# EAGLE design motherboard_v1 (EAGLE 8.4.2)
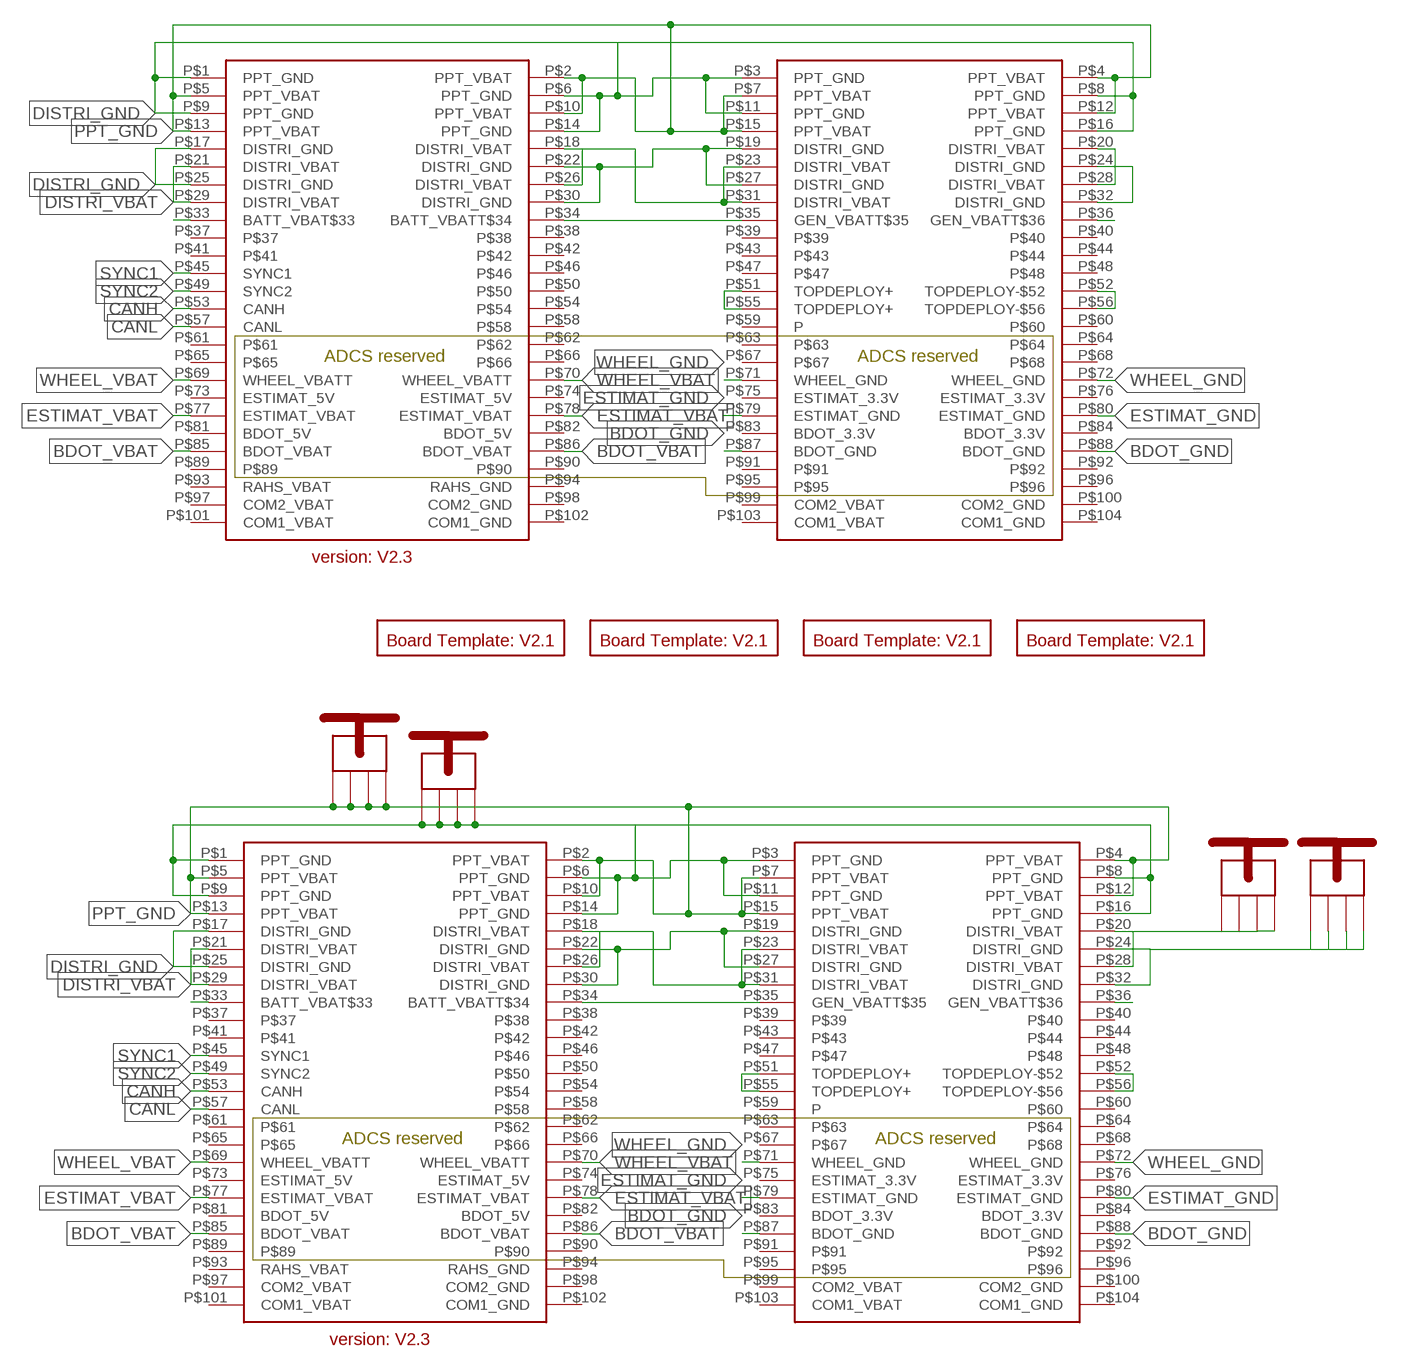
[diagram p0: schematic, sheet 1, part 1 of 2]
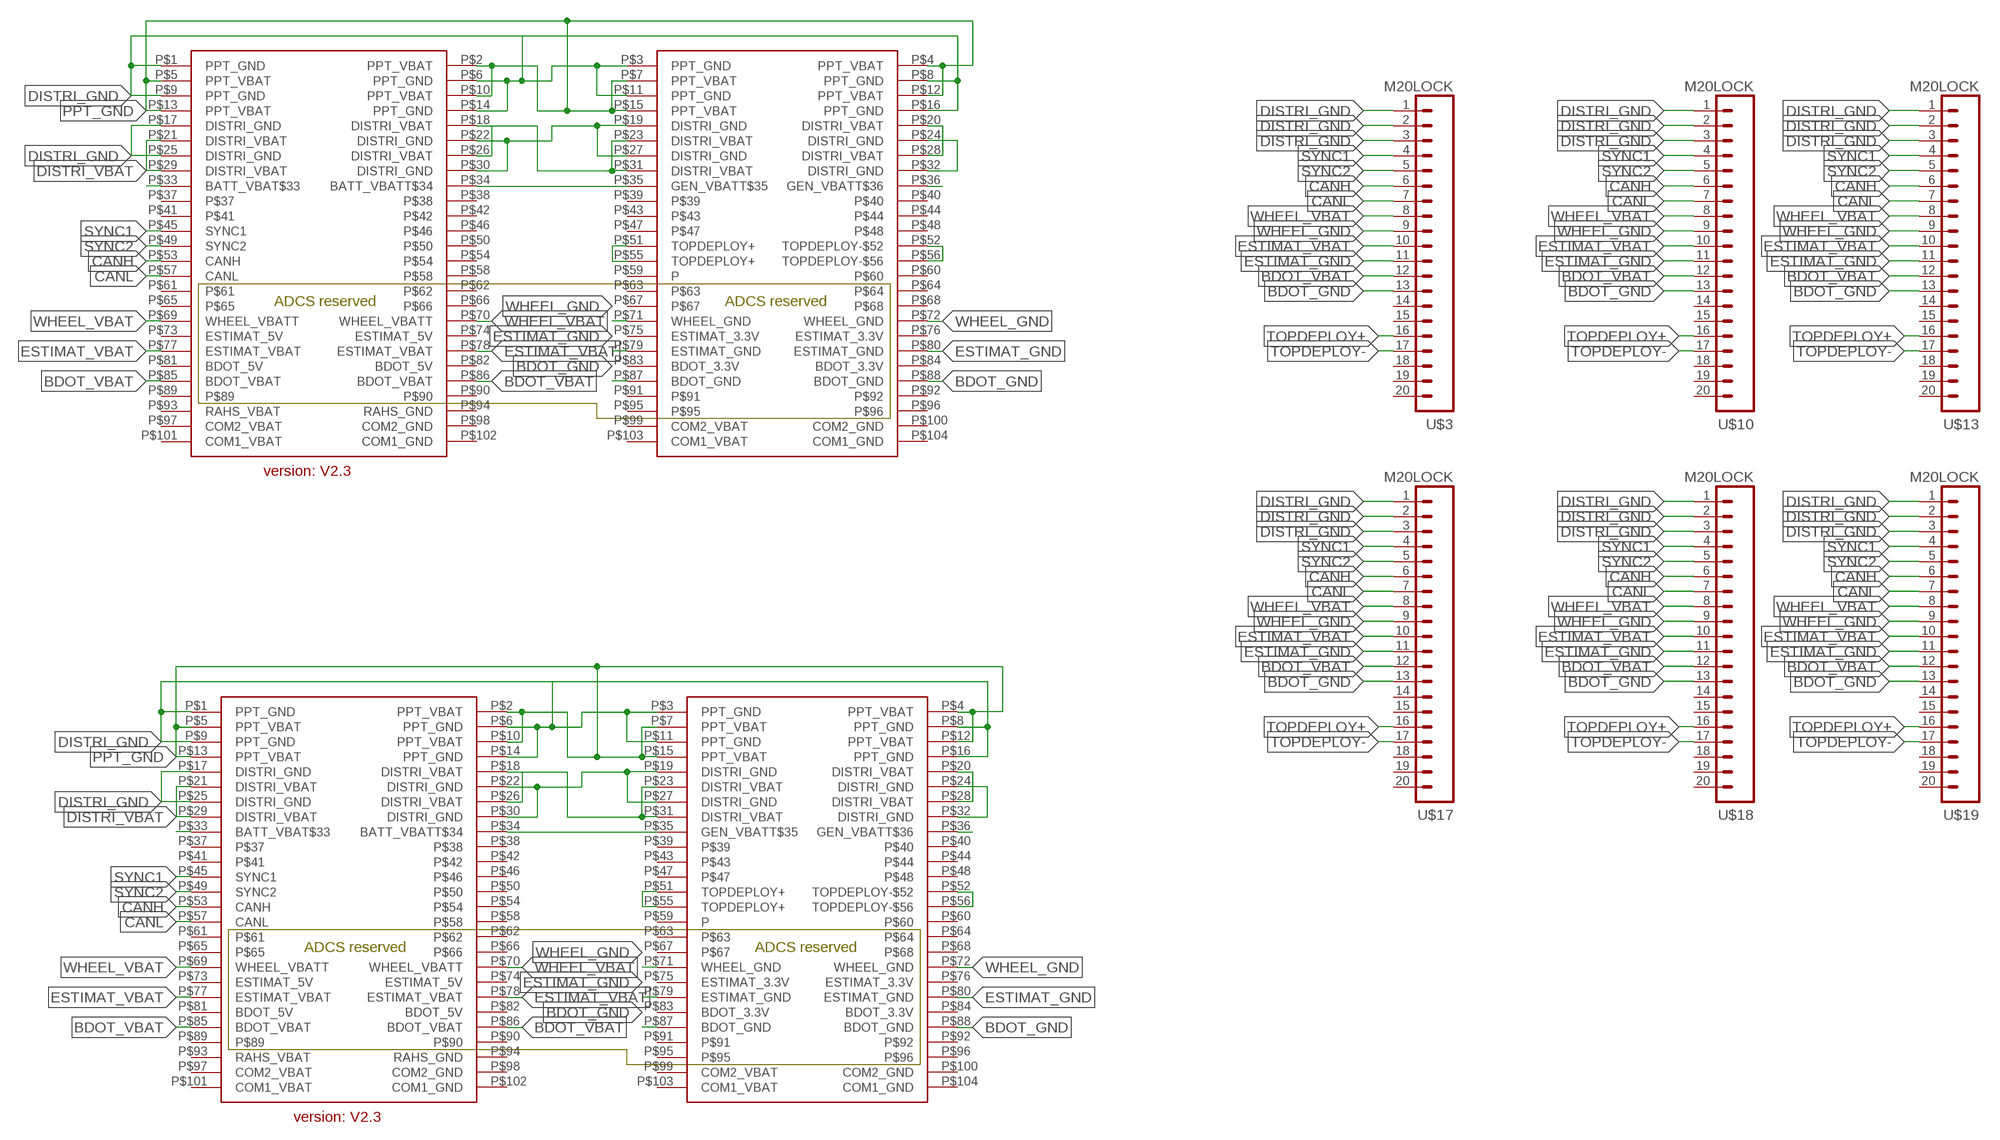
[diagram p1: schematic, sheet 1, part 2 of 2]

## Parts
JP1  KEYSTONE_SCREW_TERMINAL_7701  [7701]
JP2  KEYSTONE_SCREW_TERMINAL_7701  [7701]
JP9  KEYSTONE_SCREW_TERMINAL_7701  [7701]
JP10  KEYSTONE_SCREW_TERMINAL_7701  [7701]
U$1  BOARD_TEMPLATESILKONLY  [BOARD_TEMPLATE_SILKONLY]
U$2  PC104_CONNECTOR  [PC104_CONNECTOR]
U$3  M20LOCK  [1X20_LOCK]
U$4  BOARD_TEMPLATESILKONLY  [BOARD_TEMPLATE_SILKONLY]
U$5  BOARD_TEMPLATESILKONLY  [BOARD_TEMPLATE_SILKONLY]
U$6  BOARD_TEMPLATESILKONLY  [BOARD_TEMPLATE_SILKONLY]
U$7  PC104_CONNECTOR  [PC104_CONNECTOR]
U$9  PC104_CONNECTOR  [PC104_CONNECTOR]
U$10  M20LOCK  [1X20_LOCK]
U$11  PC104_CONNECTOR  [PC104_CONNECTOR]
U$13  M20LOCK  [1X20_LOCK]
U$17  M20LOCK  [1X20_LOCK]
U$18  M20LOCK  [1X20_LOCK]
U$19  M20LOCK  [1X20_LOCK]

## Nets
BDOT_GND: U$2.P$87(BDOT_GND) U$2.P$88(BDOT_GND) U$3.13 U$7.P$87(BDOT_GND) U$7.P$88(BDOT_GND) U$9.P$87(BDOT_GND) U$9.P$88(BDOT_GND) U$10.13 U$11.P$87(BDOT_GND) U$11.P$88(BDOT_GND) U$13.13 U$17.13 U$18.13 U$19.13
BDOT_VBAT: U$2.P$85(BDOT_VBAT) U$2.P$86(BDOT_VBAT) U$3.12 U$7.P$85(BDOT_VBAT) U$7.P$86(BDOT_VBAT) U$9.P$85(BDOT_VBAT) U$9.P$86(BDOT_VBAT) U$10.12 U$11.P$85(BDOT_VBAT) U$11.P$86(BDOT_VBAT) U$13.12 U$17.12 U$18.12 U$19.12
CANH: U$2.P$53(CANH) U$3.6 U$7.P$53(CANH) U$9.P$53(CANH) U$10.6 U$11.P$53(CANH) U$13.6 U$17.6 U$18.6 U$19.6
CANL: U$2.P$57(CANL) U$3.7 U$7.P$57(CANL) U$9.P$57(CANL) U$10.7 U$11.P$57(CANL) U$13.7 U$17.7 U$18.7 U$19.7
DISTRI_GND: JP2.P$1 JP2.P$2 JP2.P$3 JP2.P$4 JP10.P$1 JP10.P$2 JP10.P$3 JP10.P$4 U$2.P$1(PPT_GND) U$2.P$3(PPT_GND) U$2.P$6(PPT_GND) U$2.P$8(PPT_GND) U$2.P$9(PPT_GND) U$2.P$11(PPT_GND) U$2.P$14(PPT_GND) U$2.P$16(PPT_GND) U$2.P$17(DISTRI_GND) U$2.P$19(DISTRI_GND) U$2.P$22(DISTRI_GND) U$2.P$24(DISTRI_GND) U$2.P$25(DISTRI_GND) U$2.P$27(DISTRI_GND) U$2.P$30(DISTRI_GND) U$2.P$32(DISTRI_GND) U$3.1 U$3.2 U$3.3 U$7.P$1(PPT_GND) U$7.P$3(PPT_GND) U$7.P$6(PPT_GND) U$7.P$8(PPT_GND) U$7.P$9(PPT_GND) U$7.P$11(PPT_GND) U$7.P$14(PPT_GND) U$7.P$16(PPT_GND) U$7.P$17(DISTRI_GND) U$7.P$19(DISTRI_GND) U$7.P$22(DISTRI_GND) U$7.P$24(DISTRI_GND) U$7.P$25(DISTRI_GND) U$7.P$27(DISTRI_GND) U$7.P$30(DISTRI_GND) U$7.P$32(DISTRI_GND) U$9.P$1(PPT_GND) U$9.P$3(PPT_GND) U$9.P$6(PPT_GND) U$9.P$8(PPT_GND) U$9.P$9(PPT_GND) U$9.P$11(PPT_GND) U$9.P$14(PPT_GND) U$9.P$16(PPT_GND) U$9.P$17(DISTRI_GND) U$9.P$19(DISTRI_GND) U$9.P$22(DISTRI_GND) U$9.P$24(DISTRI_GND) U$9.P$25(DISTRI_GND) U$9.P$27(DISTRI_GND) U$9.P$30(DISTRI_GND) U$9.P$32(DISTRI_GND) U$10.1 U$10.2 U$10.3 U$11.P$1(PPT_GND) U$11.P$3(PPT_GND) U$11.P$6(PPT_GND) U$11.P$8(PPT_GND) U$11.P$9(PPT_GND) U$11.P$11(PPT_GND) U$11.P$14(PPT_GND) U$11.P$16(PPT_GND) U$11.P$17(DISTRI_GND) U$11.P$19(DISTRI_GND) U$11.P$22(DISTRI_GND) U$11.P$24(DISTRI_GND) U$11.P$25(DISTRI_GND) U$11.P$27(DISTRI_GND) U$11.P$30(DISTRI_GND) U$11.P$32(DISTRI_GND) U$13.1 U$13.2 U$13.3 U$17.1 U$17.2 U$17.3 U$18.1 U$18.2 U$18.3 U$19.1 U$19.2 U$19.3
DISTRI_VBAT: JP1.P$1 JP1.P$2 JP1.P$3 JP1.P$4 U$2.P$18(DISTRI_VBAT) U$2.P$20(DISTRI_VBAT) U$2.P$21(DISTRI_VBAT) U$2.P$23(DISTRI_VBAT) U$2.P$26(DISTRI_VBAT) U$2.P$28(DISTRI_VBAT) U$2.P$29(DISTRI_VBAT) U$2.P$31(DISTRI_VBAT) U$7.P$18(DISTRI_VBAT) U$7.P$20(DISTRI_VBAT) U$7.P$21(DISTRI_VBAT) U$7.P$23(DISTRI_VBAT) U$7.P$26(DISTRI_VBAT) U$7.P$28(DISTRI_VBAT) U$7.P$29(DISTRI_VBAT) U$7.P$31(DISTRI_VBAT) U$9.P$18(DISTRI_VBAT) U$9.P$20(DISTRI_VBAT) U$9.P$21(DISTRI_VBAT) U$9.P$23(DISTRI_VBAT) U$9.P$26(DISTRI_VBAT) U$9.P$28(DISTRI_VBAT) U$9.P$29(DISTRI_VBAT) U$9.P$31(DISTRI_VBAT) U$11.P$18(DISTRI_VBAT) U$11.P$20(DISTRI_VBAT) U$11.P$21(DISTRI_VBAT) U$11.P$23(DISTRI_VBAT) U$11.P$26(DISTRI_VBAT) U$11.P$28(DISTRI_VBAT) U$11.P$29(DISTRI_VBAT) U$11.P$31(DISTRI_VBAT)
EPS: U$2.P$33(BATT_VBAT$33) U$2.P$34(BATT_VBATT$34) U$2.P$35(GEN_VBATT$35) U$2.P$36(GEN_VBATT$36) U$7.P$33(BATT_VBAT$33) U$7.P$34(BATT_VBATT$34) U$7.P$35(GEN_VBATT$35) U$7.P$36(GEN_VBATT$36) U$9.P$33(BATT_VBAT$33) U$9.P$34(BATT_VBATT$34) U$9.P$35(GEN_VBATT$35) U$9.P$36(GEN_VBATT$36) U$11.P$33(BATT_VBAT$33) U$11.P$34(BATT_VBATT$34) U$11.P$35(GEN_VBATT$35) U$11.P$36(GEN_VBATT$36)
ESTIMAT_GND: U$2.P$79(ESTIMAT_GND) U$2.P$80(ESTIMAT_GND) U$3.11 U$7.P$79(ESTIMAT_GND) U$7.P$80(ESTIMAT_GND) U$9.P$79(ESTIMAT_GND) U$9.P$80(ESTIMAT_GND) U$10.11 U$11.P$79(ESTIMAT_GND) U$11.P$80(ESTIMAT_GND) U$13.11 U$17.11 U$18.11 U$19.11
ESTIMAT_VBAT: U$2.P$77(ESTIMAT_VBAT) U$2.P$78(ESTIMAT_VBAT) U$3.10 U$7.P$77(ESTIMAT_VBAT) U$7.P$78(ESTIMAT_VBAT) U$9.P$77(ESTIMAT_VBAT) U$9.P$78(ESTIMAT_VBAT) U$10.10 U$11.P$77(ESTIMAT_VBAT) U$11.P$78(ESTIMAT_VBAT) U$13.10 U$17.10 U$18.10 U$19.10
PPT_GND: JP9.P$1 JP9.P$2 JP9.P$3 JP9.P$4 U$2.P$2(PPT_VBAT) U$2.P$4(PPT_VBAT) U$2.P$5(PPT_VBAT) U$2.P$7(PPT_VBAT) U$2.P$10(PPT_VBAT) U$2.P$12(PPT_VBAT) U$2.P$13(PPT_VBAT) U$2.P$15(PPT_VBAT) U$7.P$2(PPT_VBAT) U$7.P$4(PPT_VBAT) U$7.P$5(PPT_VBAT) U$7.P$7(PPT_VBAT) U$7.P$10(PPT_VBAT) U$7.P$12(PPT_VBAT) U$7.P$13(PPT_VBAT) U$7.P$15(PPT_VBAT) U$9.P$2(PPT_VBAT) U$9.P$4(PPT_VBAT) U$9.P$5(PPT_VBAT) U$9.P$7(PPT_VBAT) U$9.P$10(PPT_VBAT) U$9.P$12(PPT_VBAT) U$9.P$13(PPT_VBAT) U$9.P$15(PPT_VBAT) U$11.P$2(PPT_VBAT) U$11.P$4(PPT_VBAT) U$11.P$5(PPT_VBAT) U$11.P$7(PPT_VBAT) U$11.P$10(PPT_VBAT) U$11.P$12(PPT_VBAT) U$11.P$13(PPT_VBAT) U$11.P$15(PPT_VBAT)
SYNC1: U$2.P$45(SYNC1) U$3.4 U$7.P$45(SYNC1) U$9.P$45(SYNC1) U$10.4 U$11.P$45(SYNC1) U$13.4 U$17.4 U$18.4 U$19.4
SYNC2: U$2.P$49(SYNC2) U$3.5 U$7.P$49(SYNC2) U$9.P$49(SYNC2) U$10.5 U$11.P$49(SYNC2) U$13.5 U$17.5 U$18.5 U$19.5
TOPDEPLOY+: U$2.P$51(TOPDEPLOY+) U$2.P$55(TOPDEPLOY+) U$3.16 U$7.P$51(TOPDEPLOY+) U$7.P$55(TOPDEPLOY+) U$9.P$51(TOPDEPLOY+) U$9.P$55(TOPDEPLOY+) U$10.16 U$11.P$51(TOPDEPLOY+) U$11.P$55(TOPDEPLOY+) U$13.16 U$17.16 U$18.16 U$19.16
TOPDEPLOY-: U$2.P$52(TOPDEPLOY-$52) U$2.P$56(TOPDEPLOY-$56) U$3.17 U$7.P$52(TOPDEPLOY-$52) U$7.P$56(TOPDEPLOY-$56) U$9.P$52(TOPDEPLOY-$52) U$9.P$56(TOPDEPLOY-$56) U$10.17 U$11.P$52(TOPDEPLOY-$52) U$11.P$56(TOPDEPLOY-$56) U$13.17 U$17.17 U$18.17 U$19.17
WHEEL_GND: U$2.P$71(WHEEL_GND) U$2.P$72(WHEEL_GND) U$3.9 U$7.P$71(WHEEL_GND) U$7.P$72(WHEEL_GND) U$9.P$71(WHEEL_GND) U$9.P$72(WHEEL_GND) U$10.9 U$11.P$71(WHEEL_GND) U$11.P$72(WHEEL_GND) U$13.9 U$17.9 U$18.9 U$19.9
WHEEL_VBAT: U$2.P$69(WHEEL_VBATT) U$2.P$70(WHEEL_VBATT) U$3.8 U$7.P$69(WHEEL_VBATT) U$7.P$70(WHEEL_VBATT) U$9.P$69(WHEEL_VBATT) U$9.P$70(WHEEL_VBATT) U$10.8 U$11.P$69(WHEEL_VBATT) U$11.P$70(WHEEL_VBATT) U$13.8 U$17.8 U$18.8 U$19.8
Unconnected: U$2.P$37 U$2.P$38 U$2.P$39 U$2.P$40 U$2.P$41 U$2.P$42 U$2.P$43 U$2.P$44 U$2.P$46 U$2.P$47 U$2.P$48 U$2.P$50 U$2.P$54 U$2.P$58 U$2.P$59(P) U$2.P$60 U$2.P$61 U$2.P$62 U$2.P$63 U$2.P$64 U$2.P$65 U$2.P$66 U$2.P$67 U$2.P$68 U$2.P$73(ESTIMAT_5V) U$2.P$74(ESTIMAT_5V) U$2.P$75(ESTIMAT_3.3V) U$2.P$76(ESTIMAT_3.3V) U$2.P$81(BDOT_5V) U$2.P$82(BDOT_5V) U$2.P$83(BDOT_3.3V) U$2.P$84(BDOT_3.3V) U$2.P$89 U$2.P$90 U$2.P$91 U$2.P$92 U$2.P$93(RAHS_VBAT) U$2.P$94(RAHS_GND) U$2.P$95 U$2.P$96 U$2.P$97(COM2_VBAT) U$2.P$98(COM2_GND) U$2.P$99(COM2_VBAT) U$2.P$100(COM2_GND) U$2.P$101(COM1_VBAT) U$2.P$102(COM1_GND) U$2.P$103(COM1_VBAT) U$2.P$104(COM1_GND) U$3.14 U$3.15 U$3.18 U$3.19 U$3.20 U$7.P$37 U$7.P$38 U$7.P$39 U$7.P$40 U$7.P$41 U$7.P$42 U$7.P$43 U$7.P$44 U$7.P$46 U$7.P$47 U$7.P$48 U$7.P$50 U$7.P$54 U$7.P$58 U$7.P$59(P) U$7.P$60 U$7.P$61 U$7.P$62 U$7.P$63 U$7.P$64 U$7.P$65 U$7.P$66 U$7.P$67 U$7.P$68 U$7.P$73(ESTIMAT_5V) U$7.P$74(ESTIMAT_5V) U$7.P$75(ESTIMAT_3.3V) U$7.P$76(ESTIMAT_3.3V) U$7.P$81(BDOT_5V) U$7.P$82(BDOT_5V) U$7.P$83(BDOT_3.3V) U$7.P$84(BDOT_3.3V) U$7.P$89 U$7.P$90 U$7.P$91 U$7.P$92 U$7.P$93(RAHS_VBAT) U$7.P$94(RAHS_GND) U$7.P$95 U$7.P$96 U$7.P$97(COM2_VBAT) U$7.P$98(COM2_GND) U$7.P$99(COM2_VBAT) U$7.P$100(COM2_GND) U$7.P$101(COM1_VBAT) U$7.P$102(COM1_GND) U$7.P$103(COM1_VBAT) U$7.P$104(COM1_GND) U$9.P$37 U$9.P$38 U$9.P$39 U$9.P$40 U$9.P$41 U$9.P$42 U$9.P$43 U$9.P$44 U$9.P$46 U$9.P$47 U$9.P$48 U$9.P$50 U$9.P$54 U$9.P$58 U$9.P$59(P) U$9.P$60 U$9.P$61 U$9.P$62 U$9.P$63 U$9.P$64 U$9.P$65 U$9.P$66 U$9.P$67 U$9.P$68 U$9.P$73(ESTIMAT_5V) U$9.P$74(ESTIMAT_5V) U$9.P$75(ESTIMAT_3.3V) U$9.P$76(ESTIMAT_3.3V) U$9.P$81(BDOT_5V) U$9.P$82(BDOT_5V) U$9.P$83(BDOT_3.3V) U$9.P$84(BDOT_3.3V) U$9.P$89 U$9.P$90 U$9.P$91 U$9.P$92 U$9.P$93(RAHS_VBAT) U$9.P$94(RAHS_GND) U$9.P$95 U$9.P$96 U$9.P$97(COM2_VBAT) U$9.P$98(COM2_GND) U$9.P$99(COM2_VBAT) U$9.P$100(COM2_GND) U$9.P$101(COM1_VBAT) U$9.P$102(COM1_GND) U$9.P$103(COM1_VBAT) U$9.P$104(COM1_GND) U$10.14 U$10.15 U$10.18 U$10.19 U$10.20 U$11.P$37 U$11.P$38 U$11.P$39 U$11.P$40 U$11.P$41 U$11.P$42 U$11.P$43 U$11.P$44 U$11.P$46 U$11.P$47 U$11.P$48 U$11.P$50 U$11.P$54 U$11.P$58 U$11.P$59(P) U$11.P$60 U$11.P$61 U$11.P$62 U$11.P$63 U$11.P$64 U$11.P$65 U$11.P$66 U$11.P$67 U$11.P$68 U$11.P$73(ESTIMAT_5V) U$11.P$74(ESTIMAT_5V) U$11.P$75(ESTIMAT_3.3V) U$11.P$76(ESTIMAT_3.3V) U$11.P$81(BDOT_5V) U$11.P$82(BDOT_5V) U$11.P$83(BDOT_3.3V) U$11.P$84(BDOT_3.3V) U$11.P$89 U$11.P$90 U$11.P$91 U$11.P$92 U$11.P$93(RAHS_VBAT) U$11.P$94(RAHS_GND) U$11.P$95 U$11.P$96 U$11.P$97(COM2_VBAT) U$11.P$98(COM2_GND) U$11.P$99(COM2_VBAT) U$11.P$100(COM2_GND) U$11.P$101(COM1_VBAT) U$11.P$102(COM1_GND) U$11.P$103(COM1_VBAT) U$11.P$104(COM1_GND) U$13.14 U$13.15 U$13.18 U$13.19 U$13.20 U$17.14 U$17.15 U$17.18 U$17.19 U$17.20 U$18.14 U$18.15 U$18.18 U$18.19 U$18.20 U$19.14 U$19.15 U$19.18 U$19.19 U$19.20

## Library data of the parts
JP1 JP2 JP9 JP10 = I_O_connectors:KEYSTONE_SCREW_TERMINAL_7701
U$1 U$4-U$6 = DubSat1 Components:BOARD_TEMPLATE
U$2 U$7 U$9 U$11 = DubSat1 Components:PC104_CONNECTOR
U$3 U$10 U$13 U$17-U$19 = SparkFun-Connectors:M20: 1x20 .1" header This is just like the LOCK variant in that the holes are staggared by 5 mil, but except for the last two holes. They are not altered from the "standard" footprint layout. This is used for a special purpose on the layout of our Graphic LCD Backpack. Make sure you want to use this device before selecting it for you project!

## Board
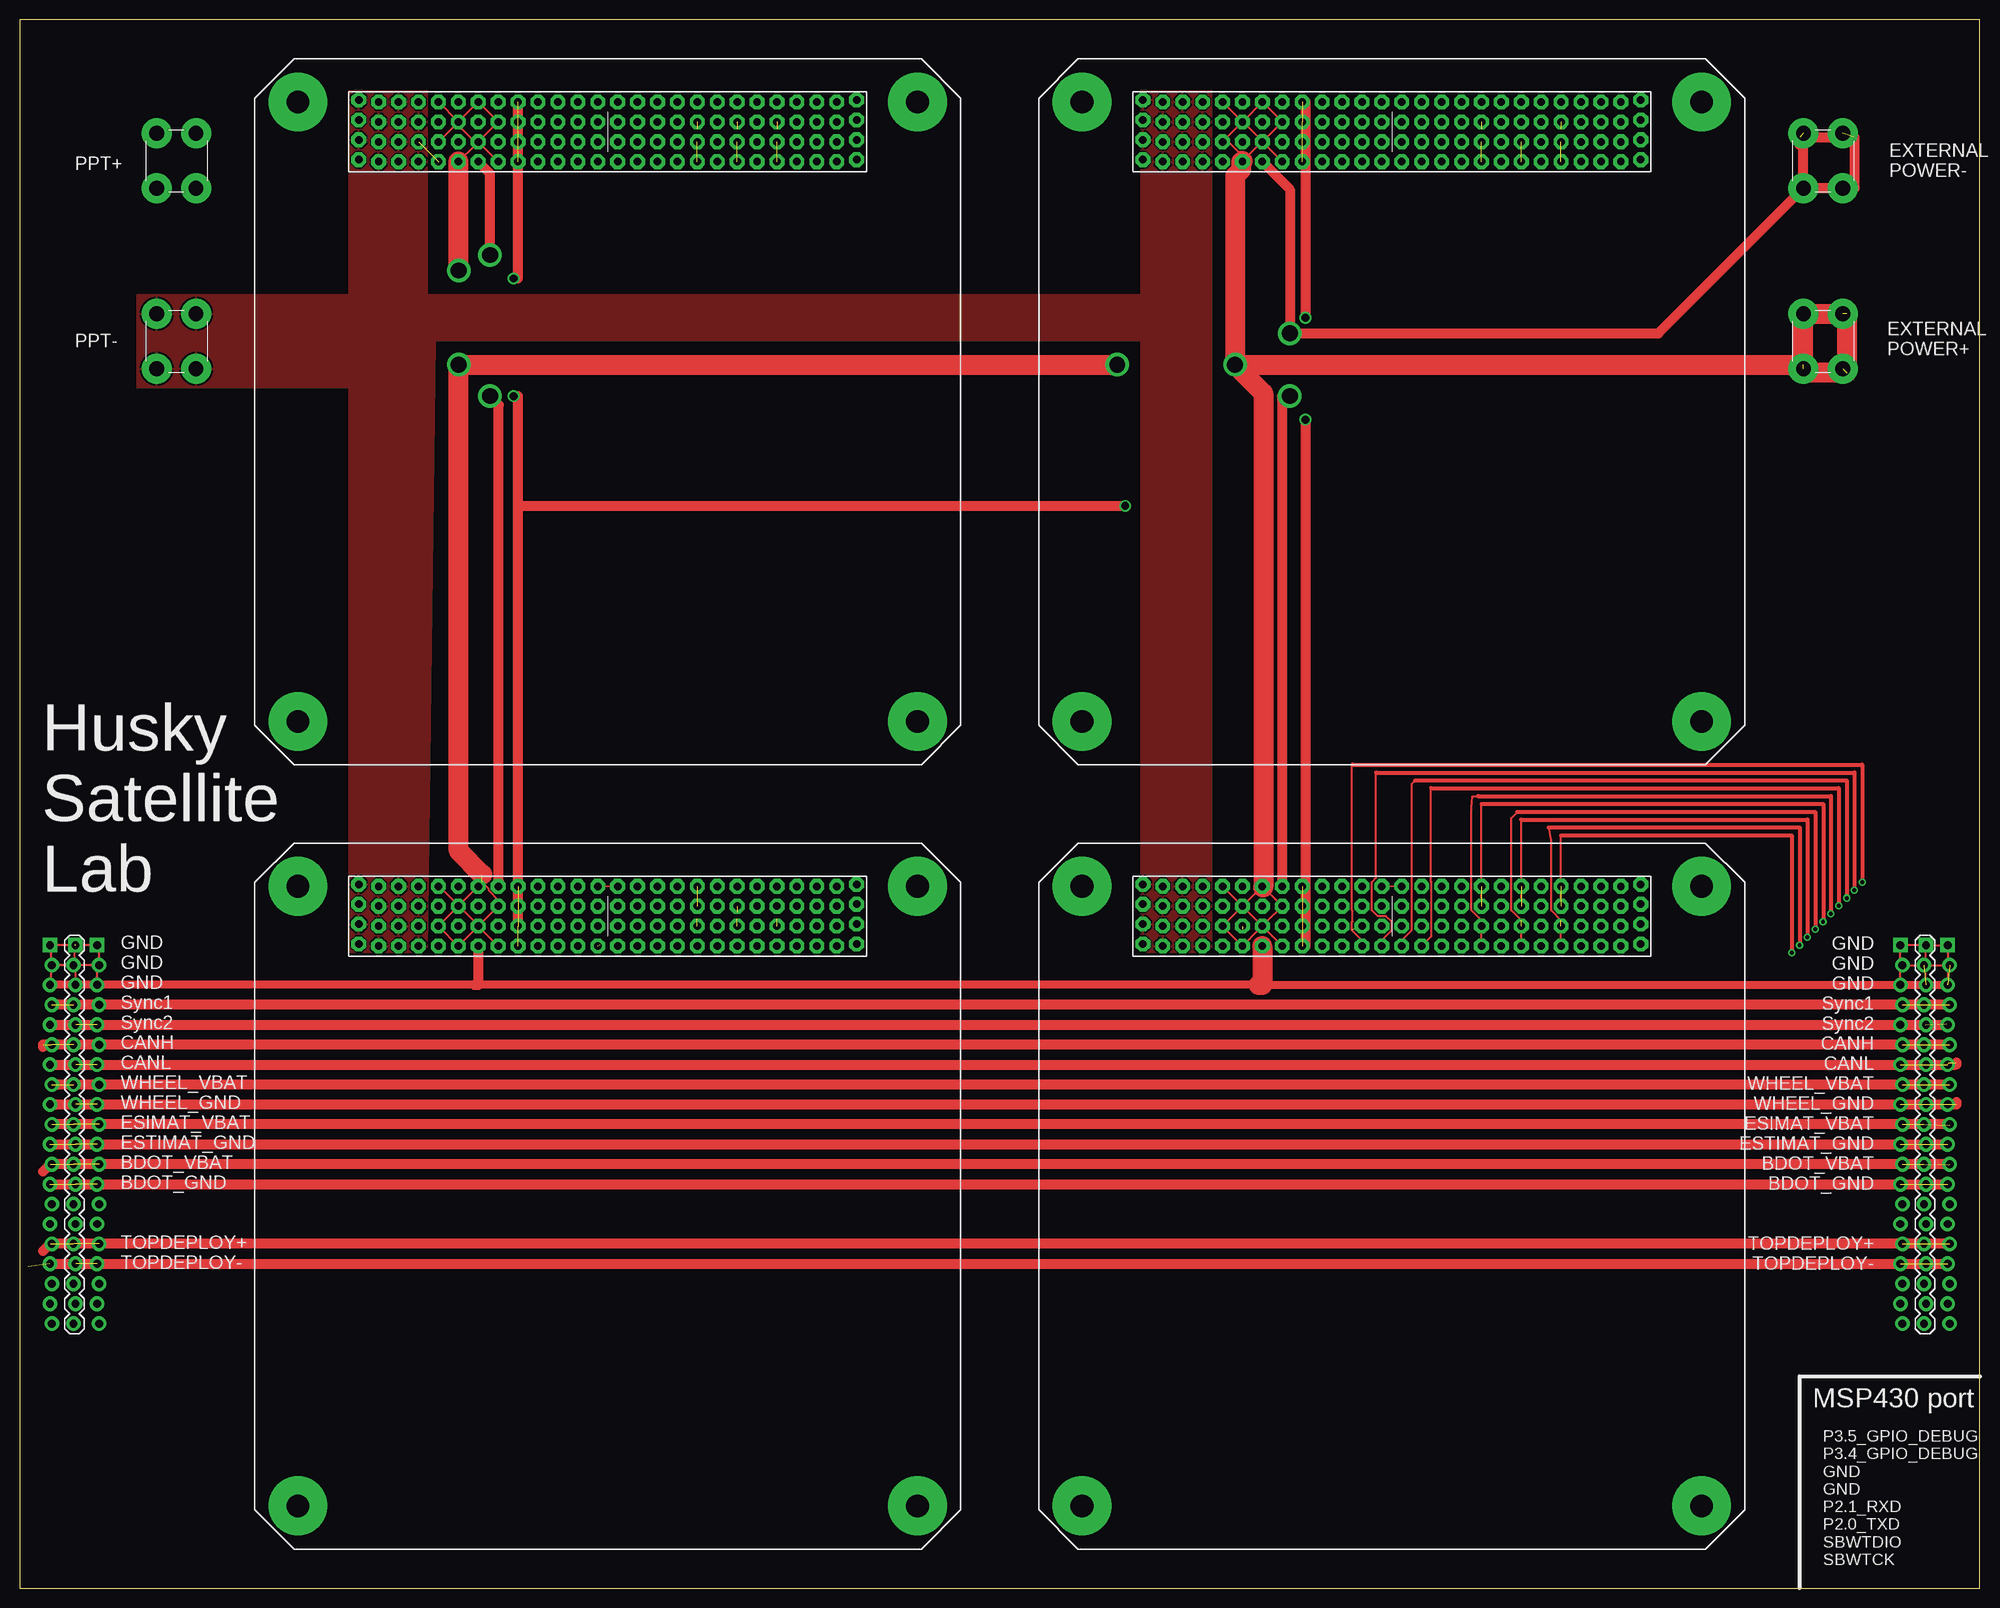
[diagram p2: board, top side]
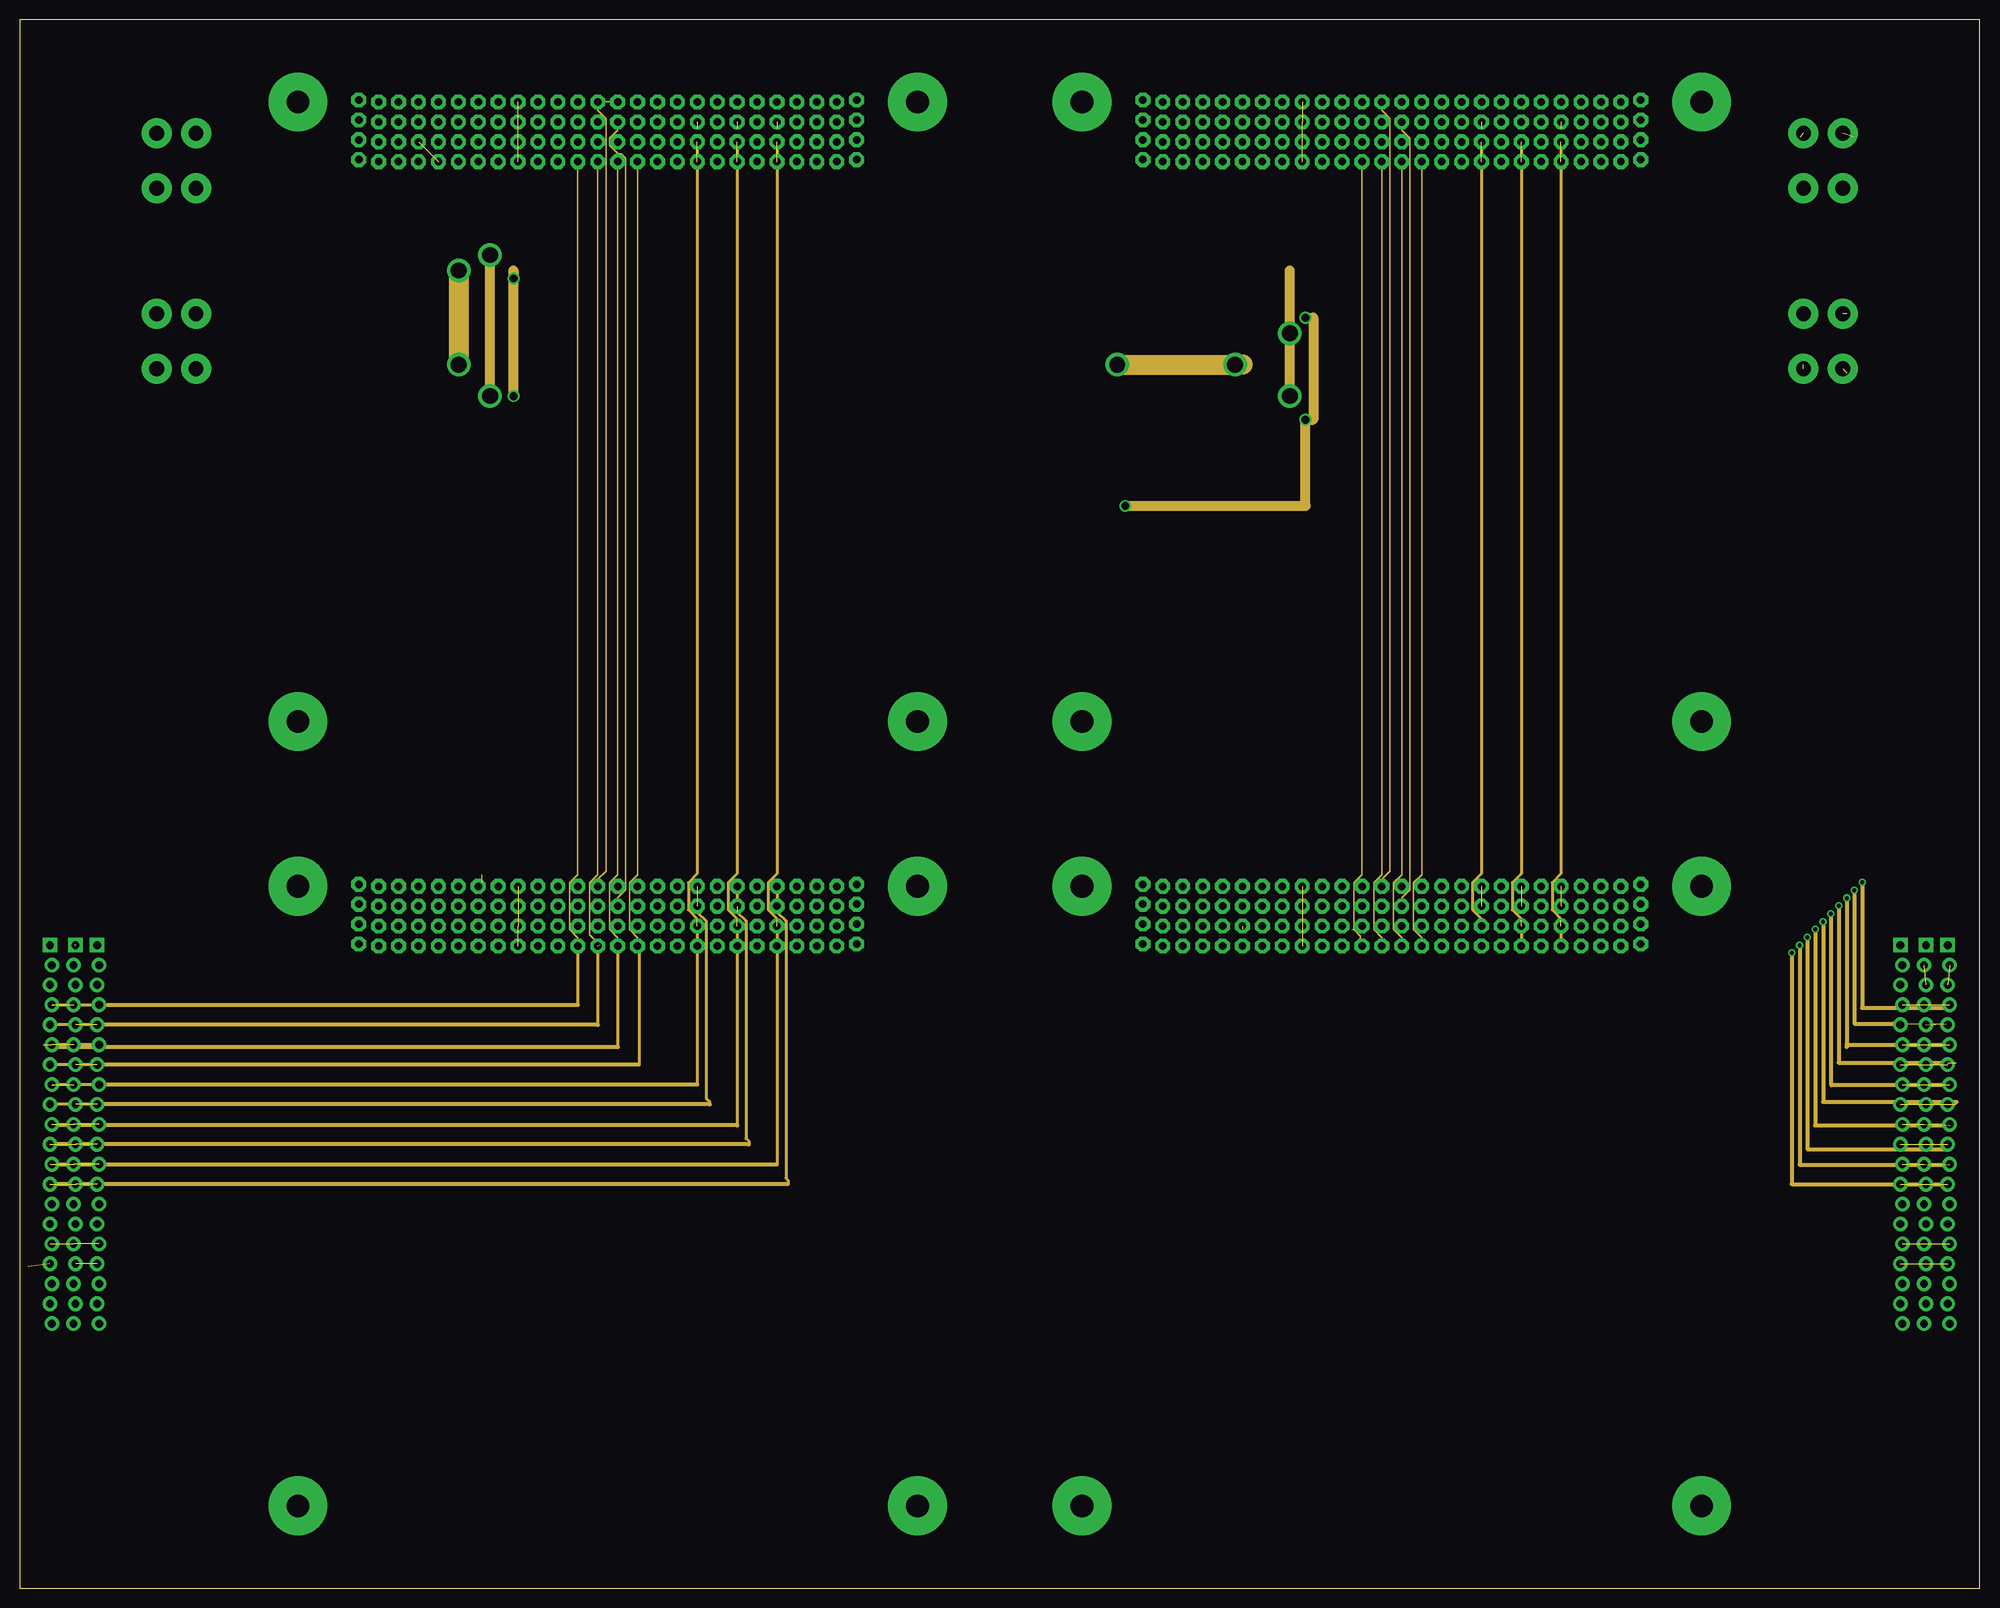
[diagram p3: board, inner layer Route2]
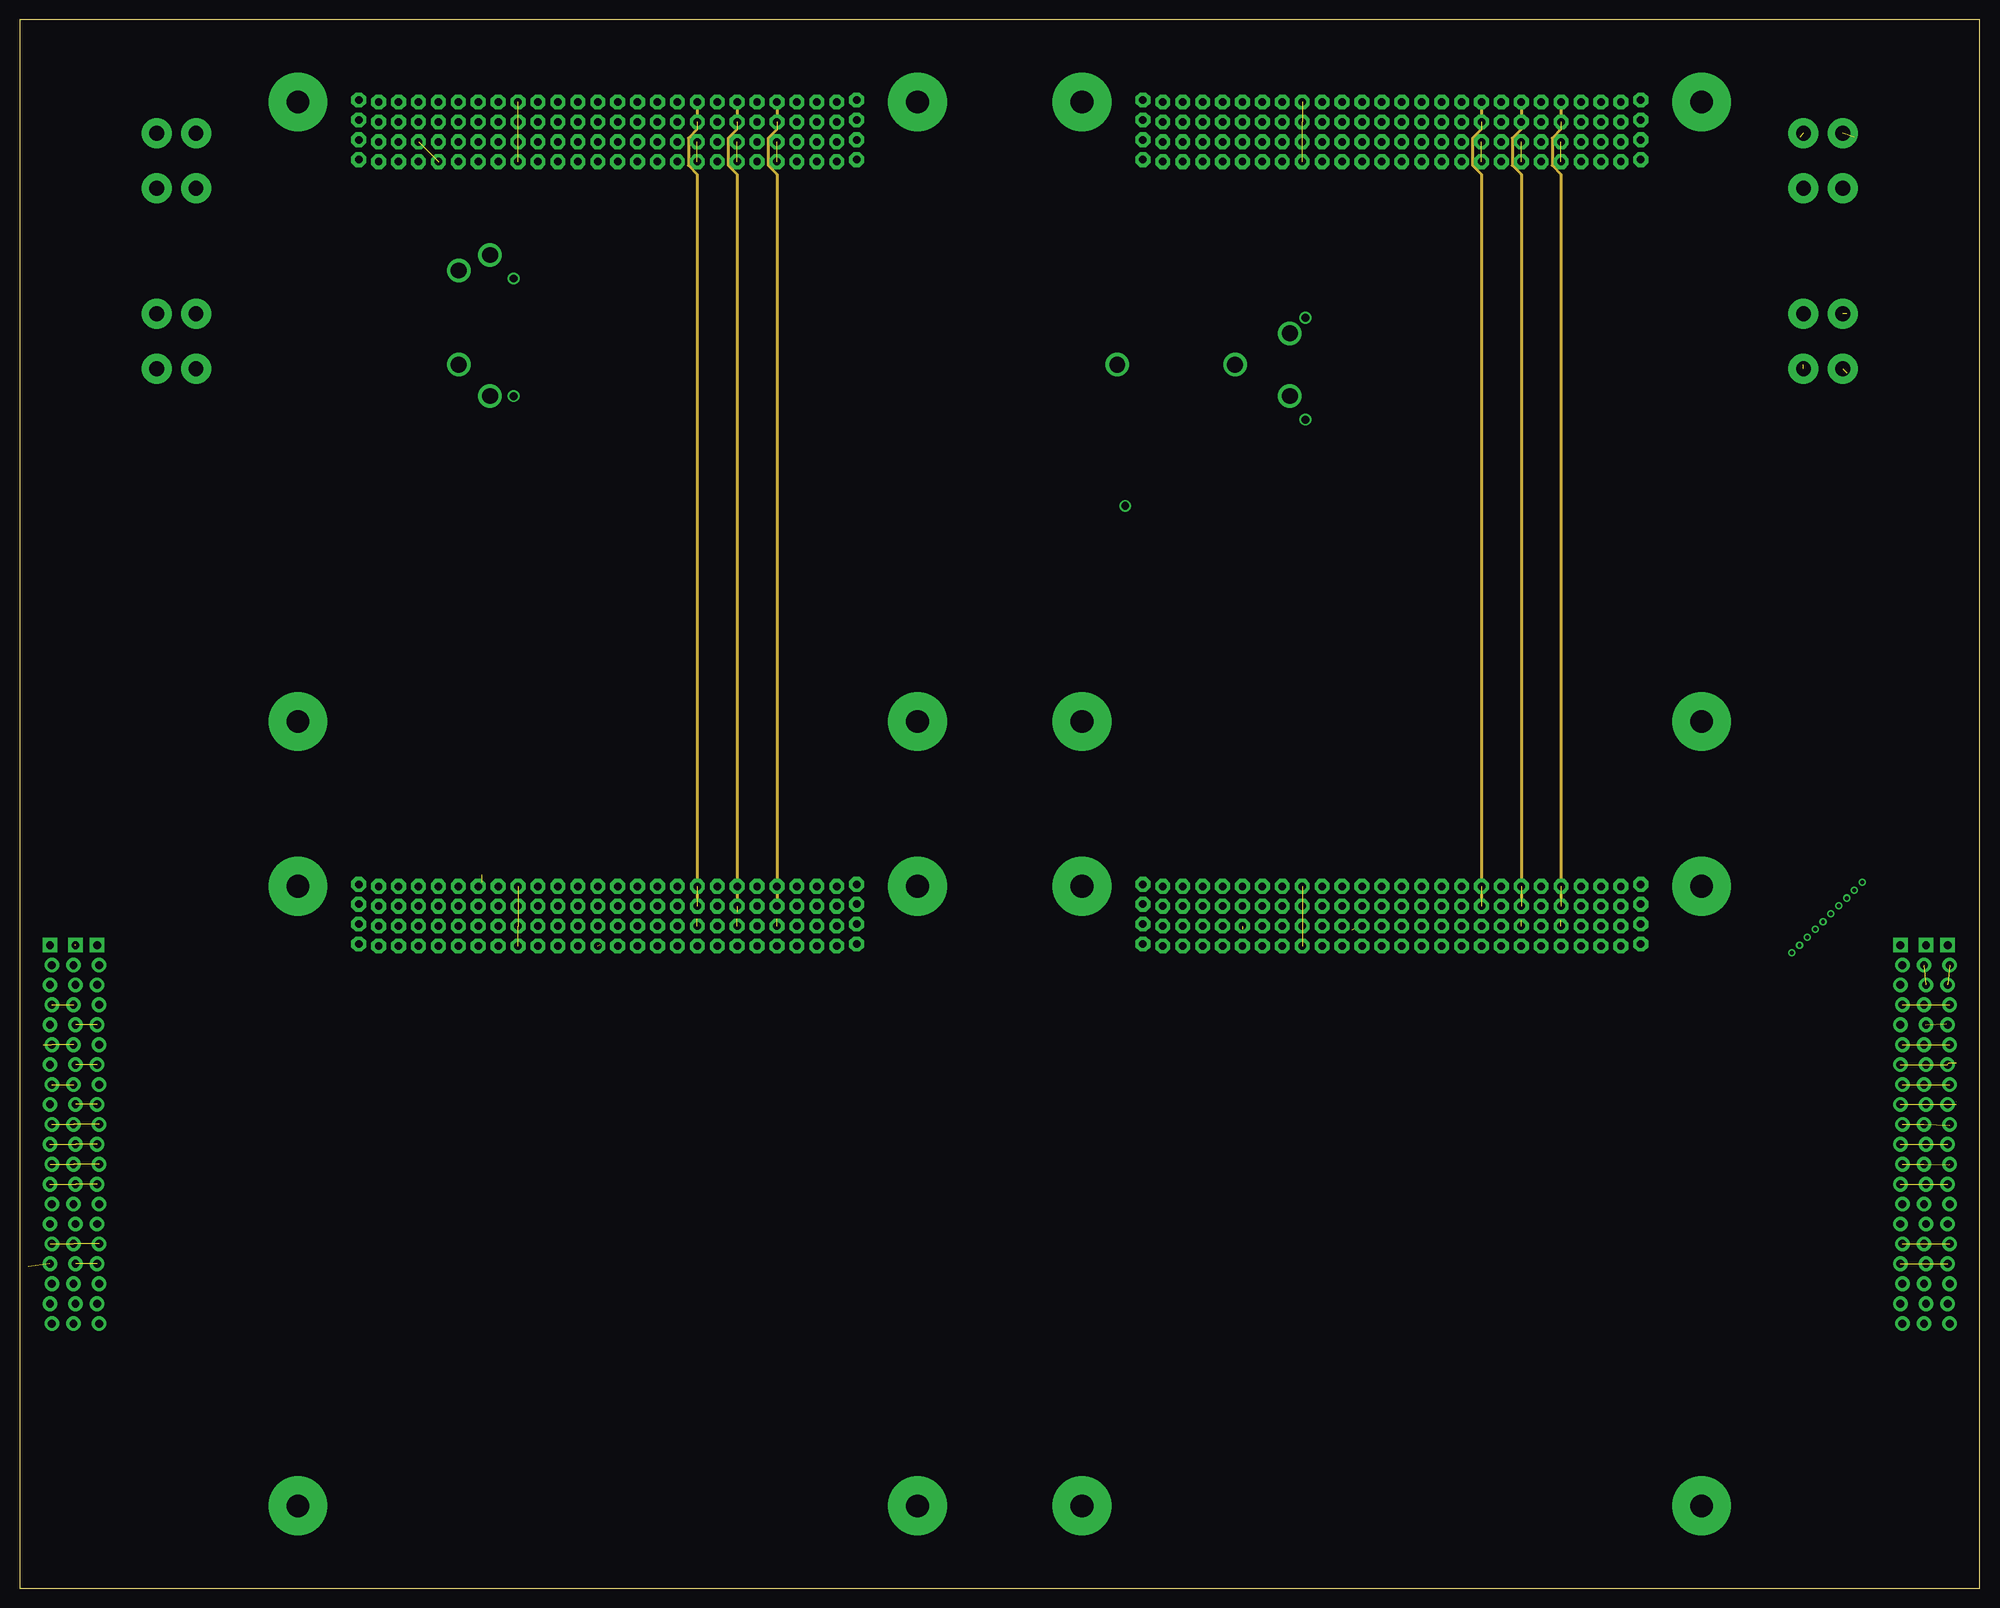
[diagram p4: board, inner layer Route3]
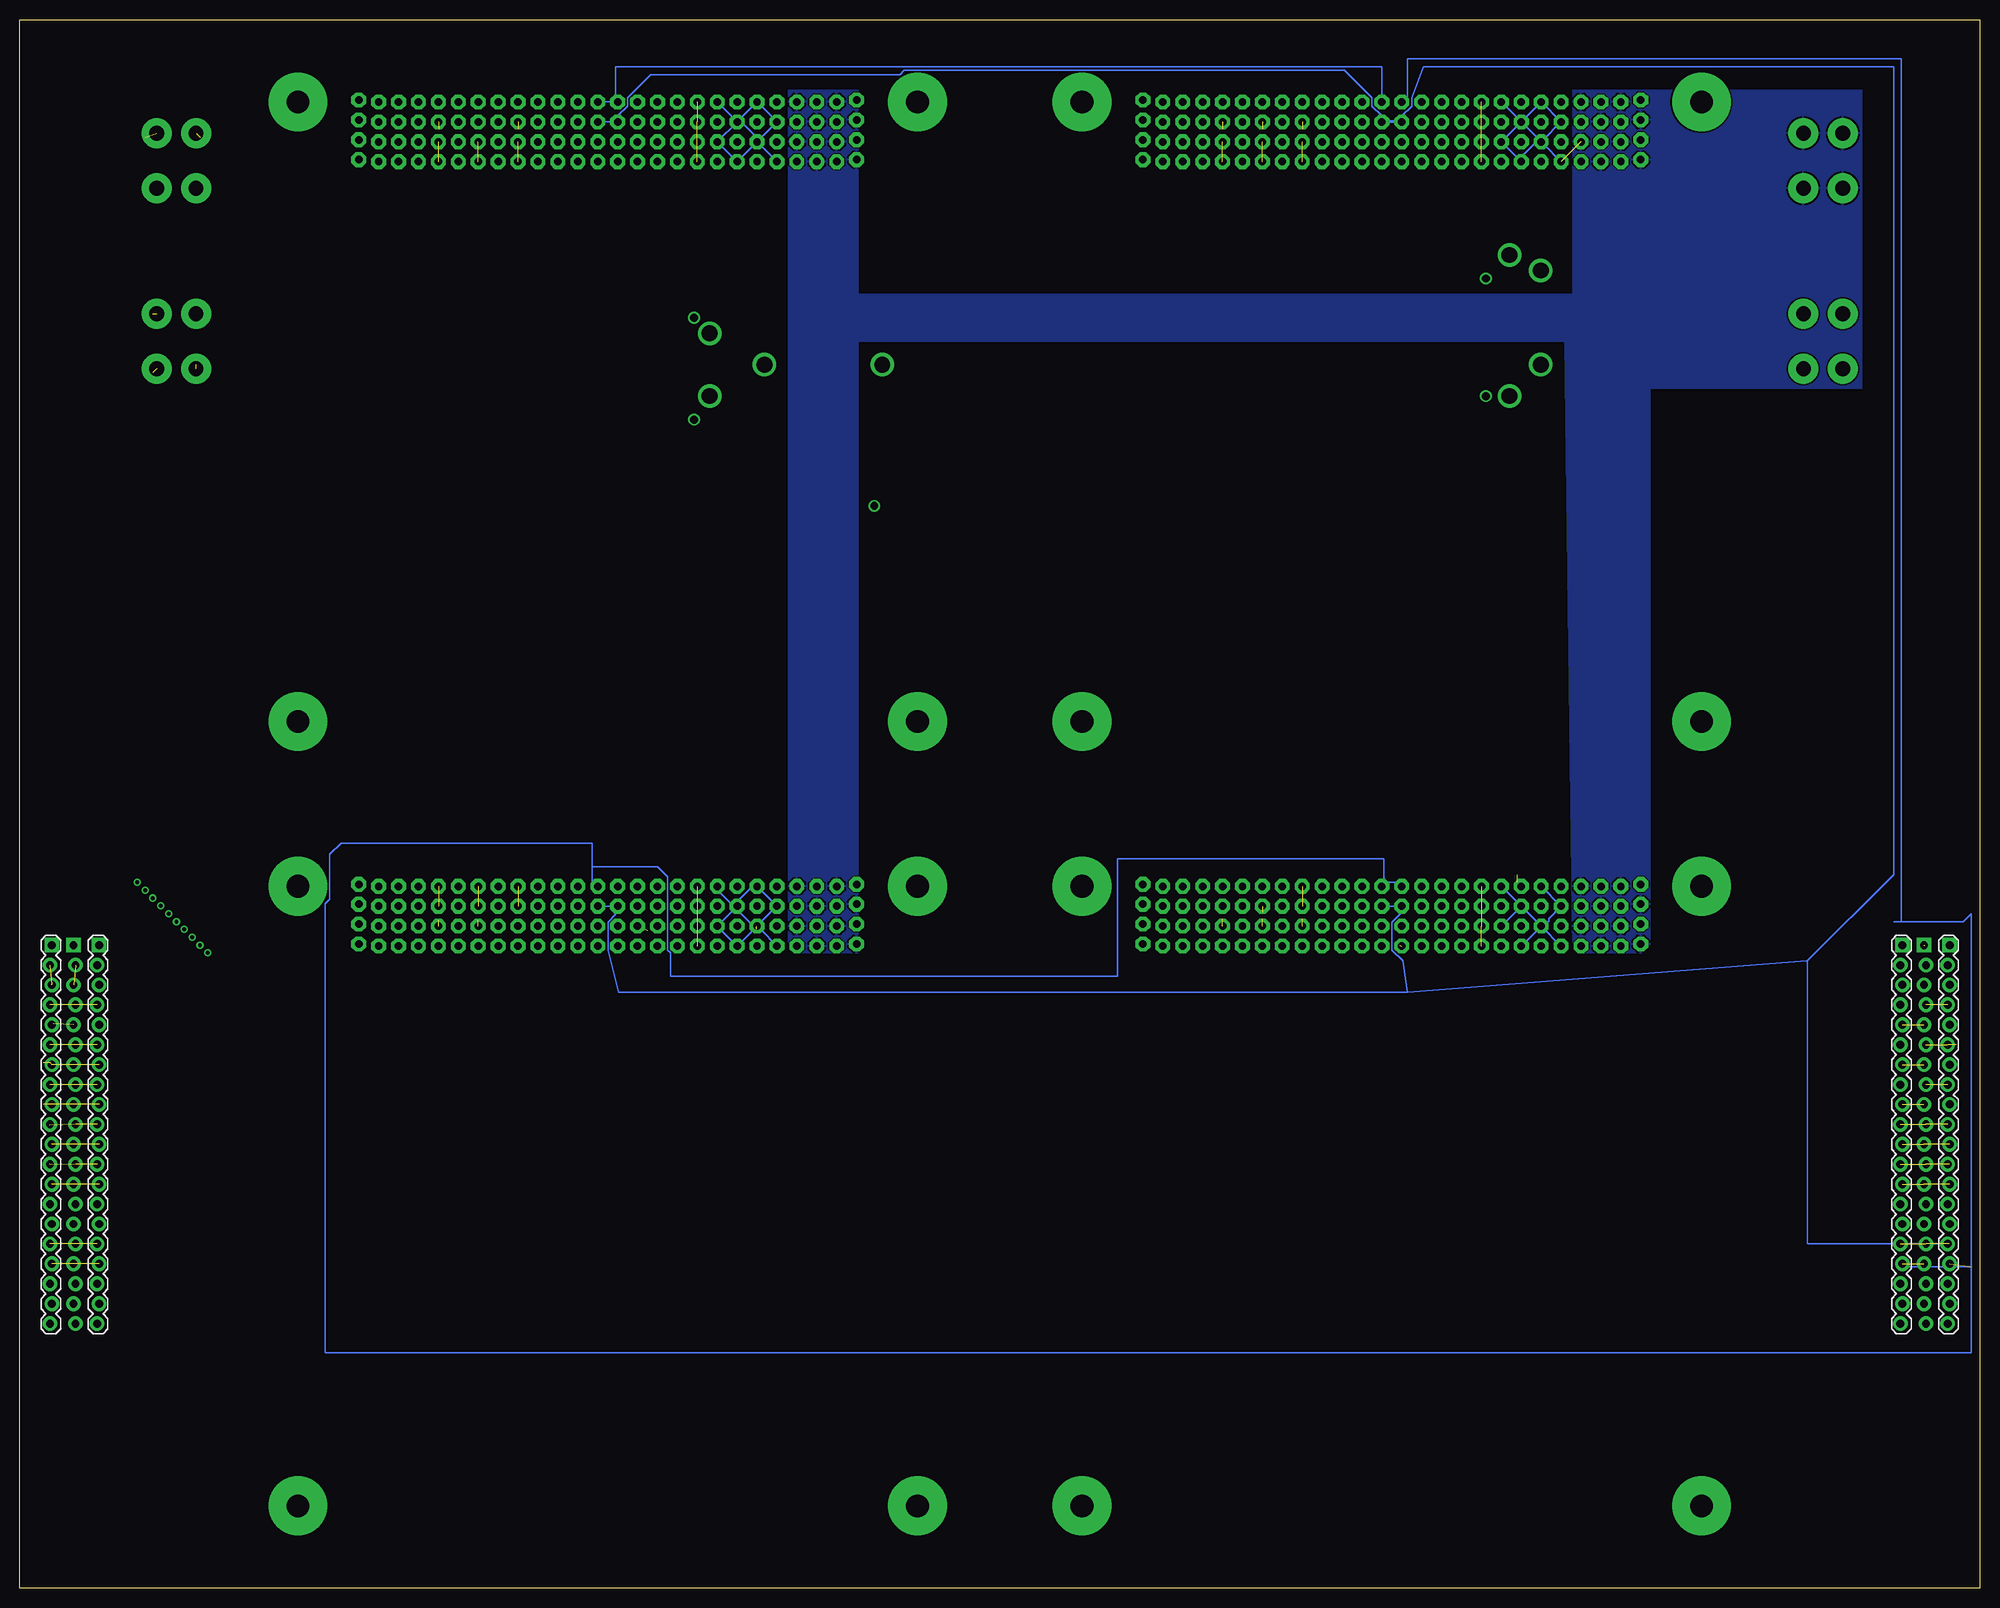
[diagram p5: board, bottom side, seen from below]

Size 250 x 200 mm. Coordinates in mm from the lower left corner, seen from the top.
Outline: 0,0 250,0 250,200 0,200 0,0
Copper layers (1*2*3*16): Top 0.035mm / dielectric 1.5mm / Route2 0.035mm / dielectric 0.15mm / Route3 0.035mm / dielectric 0.2mm / Bottom 0.035mm
Design rules "default *": minimum track width 6mil, minimum drill 0.35mm, track to track 8mil, track to pad 8mil, pad to pad 8mil, via to via 8mil, smd to smd 8mil, copper to edge 40mil, drill to drill 6mil, minimum pad ring 10mil, minimum via ring 8mil, stop-mask expansion 4mil, vias tented up to drill 0mil, thermal gap 10mil

### Footprints (pad centres in the part's own frame; a part is rotated, then mirrored left to right if it is on the bottom)
7701 = drill 1.88 pad 3.81: P$1 -2.502,3.505; P$2 2.502,3.505; P$3 2.502,-3.505; P$4 -2.502,-3.505
BOARD_TEMPLATE_SILKONLY = drill 2.9 pad 7.5: P$1 -39.5,39.5; P$2 -39.5,-39.5; P$3 39.5,-39.5; P$4 39.5,39.5
PC104_CONNECTOR = drill 0.953 pad 1.88 octagon: P$1 -31.75,32.134; P$2 -31.75,34.674; P$3 -31.75,37.214; P$4 -31.75,39.754; P$5 -29.21,31.88; P$6 -29.21,34.42; P$7 -29.21,36.96; P$8 -29.21,39.5; P$9 -26.67,31.88; P$10 -26.67,34.42; P$11 -26.67,36.96; P$12 -26.67,39.5; P$13 -24.13,31.88; P$14 -24.13,34.42; P$15 -24.13,36.96; P$16 -24.13,39.5; P$17 -21.59,31.88; P$18 -21.59,34.42; P$19 -21.59,36.96; P$20 -21.59,39.5; P$21 -19.05,31.88; P$22 -19.05,34.42; P$23 -19.05,36.96; P$24 -19.05,39.5; P$25 -16.51,31.88; P$26 -16.51,34.42; P$27 -16.51,36.96; P$28 -16.51,39.5; P$29 -13.97,31.88; P$30 -13.97,34.42; P$31 -13.97,36.96; P$32 -13.97,39.5; P$33 -11.43,31.88; P$34 -11.43,34.42; P$35 -11.43,36.96; P$36 -11.43,39.5; P$37 -8.89,31.88; P$38 -8.89,34.42; P$39 -8.89,36.96; P$40 -8.89,39.5; P$41 -6.35,31.88; P$42 -6.35,34.42; P$43 -6.35,36.96; P$44 -6.35,39.5; P$45 -3.81,31.88; P$46 -3.81,34.42; P$47 -3.81,36.96; P$48 -3.81,39.5; P$49 -1.27,31.88; P$50 -1.27,34.42; P$51 -1.27,36.96; P$52 -1.27,39.5; P$53 1.27,31.88; P$54 1.27,34.42; P$55 1.27,36.96; P$56 1.27,39.5; P$57 3.81,31.88; P$58 3.81,34.42; P$59 3.81,36.96; P$60 3.81,39.5; P$61 6.35,31.88; P$62 6.35,34.42; P$63 6.35,36.96; P$64 6.35,39.5; P$65 8.89,31.88; P$66 8.89,34.42; P$67 8.89,36.96; P$68 8.89,39.5; P$69 11.43,31.88; P$70 11.43,34.42; P$71 11.43,36.96; P$72 11.43,39.5; P$73 13.97,31.88; P$74 13.97,34.42; P$75 13.97,36.96; P$76 13.97,39.5; P$77 16.51,31.88; P$78 16.51,34.42; P$79 16.51,36.96; P$80 16.51,39.5; P$81 19.05,31.88; P$82 19.05,34.42; P$83 19.05,36.96; P$84 19.05,39.5; P$85 21.59,31.88; P$86 21.59,34.42; P$87 21.59,36.96; P$88 21.59,39.5; P$89 24.13,31.88; P$90 24.13,34.42; P$91 24.13,36.96; P$92 24.13,39.5; P$93 26.67,31.88; P$94 26.67,34.42; P$95 26.67,36.96; P$96 26.67,39.5; P$97 29.21,31.88; P$98 29.21,34.42; P$99 29.21,36.96; P$100 29.21,39.5; P$101 31.75,32.134; P$102 31.75,34.674; P$103 31.75,37.214; P$104 31.75,39.754
1X20_LOCK = drill 1.016 pad 1.88 square: 1 0,0.127 | drill 1.016 pad 1.88: 2 2.54,-0.127; 3 5.08,0.127; 4 7.62,-0.127; 5 10.16,0.127; 6 12.7,-0.127; 7 15.24,0.127; 8 17.78,-0.127; 9 20.32,0.127; 10 22.86,-0.127; 11 25.4,0.127; 12 27.94,-0.127; 13 30.48,0.127; 14 33.02,-0.127; 15 35.56,0.127; 16 38.1,-0.127; 17 40.64,0.127; 18 43.18,-0.127; 19 45.72,0.127; 20 48.26,-0.127

### Placement (x,y rotation side)
JP1  230,159 0 top
JP2  230,182 0 top
JP9  20,159 0 top
JP10  20,182 0 top
U$1  75,150 0 top
U$2  175,50 0 top
U$3  4,82 270 bottom
U$4  75,50 0 top
U$5  175,150 0 top
U$6  175,50 0 top
U$7  75,50 0 top
U$9  75,150 0 top
U$10  7,82 270 top
U$11  175,150 0 top
U$13  10,82 270 bottom
U$17  240,82 270 bottom
U$18  243,82 270 top
U$19  246,82 270 bottom

### Tracks (layer width: path | path; a pad name or v marks a point on that pad's centre or on a via)
BDOT_GND  (via drill 0.5)  (7 unrouted)
  Top 0.254: U$2.P$87 196.59,96
  Top 0.508: 196.59,96 226,96 v226,81
  Top 1.27: U$3.13 U$19.13
  Route2 0.406: U$7.P$88 U$7.P$87 96.59,86.22 97.73,85.08 97.73,52.27 98,52 98,51.52
  Route2 0.508: 98,51.52 U$3.13 | U$19.13 226,51.52 v226,81
  Route3 0.406: U$9.P$88 96.59,186.03 95.45,184.89 95.45,181.41 96.59,180.27 U$7.P$87 | U$11.P$88 196.59,186.03 195.45,184.89 195.45,181.41 196.59,180.27 U$2.P$87
BDOT_VBAT  (via drill 0.5)  (10 unrouted)
  Top 0.254: U$2.P$85 196.59,85.16 195.32,86.43 195.32,95.38 195,97
  Top 0.508: 195,97 227,97 v227,82
  Top 1.27: U$19.12 3.9,54.06 3,53.16
  Route2 0.406: U$9.P$86 96.59,91.11 95.45,89.97 95.45,86.49 96.59,85.35 U$7.P$85 96.59,54 | U$11.P$86 196.59,91.11 195.45,89.97 195.45,86.49 196.59,85.35 U$2.P$85 | 4.13,54 U$3.12
  Route2 0.508: 96.59,54 4.13,54 | v227,82 227,54 246,54
CANH  (via drill 0.5)  (5 unrouted)
  Top 0.254: U$2.P$53 176.27,82.62 177.54,83.89 177.54,102.54 178,103
  Top 0.508: 178,103 233,103 v233,88
  Top 1.27: U$19.6 3,69.3 3,69
  Route2 0.203: U$9.P$53 76.27,90.96 75.23,89.93 75.23,83.99 76.27,82.96 U$7.P$53 | U$11.P$53 176.27,90.96 175.24,89.93 175.24,83.99 176.27,82.96 U$2.P$53
  Route2 0.254: 233,69 233,69.3
  Route2 0.406: U$7.P$53 76.27,69 | U$13.6 10.13,69 | U$13.6 4,69.3 4,69 10.13,69 | 10.13,69 U$13.6
  Route2 0.508: 76.27,69 10.13,69 | v233,88 233,69 | 233,69.3 U$19.6
CANL  (via drill 0.5)  (5 unrouted)
  Top 0.254: 180,102 180,90.11 180.08,90.03 180.08,83.15 U$2.P$57
  Top 0.508: 180,102 232,102 v232,87
  Top 1.27: U$3.7 247,66.76 247,67
  Route2 0.203: U$9.P$57 78.81,90.96 77.78,89.93 77.78,83.99 78.81,82.96 U$7.P$57 | U$11.P$57 178.81,90.96 177.78,89.93 177.78,83.99 178.81,82.96 U$2.P$57
  Route2 0.406: U$7.P$57 79,81.88 79,66.76 | U$13.7 U$3.7
  Route2 0.508: 79,66.76 U$13.7 | v232,87 232,67 246,67
DISTRI_GND  (via drill 2)  (8 unrouted)
  Top 0.254: 245,76.92 245,77 245.87,77 U$19.1 U$18.1 | U$18.1 U$17.1 U$17.3 | U$17.2 U$19.2 | U$18.3 U$18.1 | 7,82 U$13.1 10.13,82 U$13.2 9.87,79.46 | 7,82 U$3.1 4,82 4,80 | 9.87,79.46 7.13,79.46 | U$3.3 4,76.92 4,80 | 4,80 4.13,80 U$3.2 U$10.2 7,79.46 | 7,79.46 7,82 | U$10.3 7.13,79.46 | 7.13,79.46 7,79.46 | U$13.3 9.87,79.46
  Top 1: 245,76.92 158,76.92 58,76.92 U$3.3
  Top 1.27: U$2.P$32 161.03,152 v162,152 | U$11.P$25 162,178.37 v162,160 209,160 JP2.P$4 227.5,184 227,184 227,185 234,185 234,178.5 JP2.P$3 228,178.5 228,178 | 58,76.92 58.49,76.92 U$7.P$25 | U$7.P$32 61.03,90.05 61.11,90.13 61.11,150.89 v60,152 | v60,170 60,180.37 U$9.P$25
  Top 2.54: U$2.P$25 158.49,76.92 158,76.92
  Route2 1.27: v162,152 v162,160 162,168 | v60,152 v60,170
  Bottom 0.203: U$9.P$27 U$9.P$24 U$9.P$19 55.69,184.69 | 55.69,184.69 U$9.P$22 | U$9.P$22 U$9.P$27 | U$9.P$27 U$9.P$32 | U$9.P$27 U$9.P$30 58.81,182.19 | 58.81,182.19 U$9.P$25 | U$9.P$22 56.58,184.42 58.81,182.19 | U$9.P$17 55.69,184.16 55.69,184.69 | U$11.P$17 U$11.P$22 | U$11.P$22 U$11.P$19 U$11.P$24 158.22,187.22 | 158.22,187.22 158.45,187 | 158.45,187 159,187 159,186.96 U$11.P$27 U$11.P$32 | U$11.P$22 155.95,184.95 158.22,187.22 | U$11.P$22 U$11.P$25 U$11.P$30 158.45,187 | U$7.P$24 U$7.P$19 55,85.37 55,85 55.95,85 U$7.P$22 | U$7.P$22 U$7.P$27 | U$7.P$27 U$7.P$32 | U$7.P$22 U$7.P$25 | U$7.P$17 U$7.P$22 | U$7.P$27 U$7.P$30 | 159,87 156.5,89.5 U$2.P$24 U$2.P$19 153.46,86.96 156,84.42 | 159,87 159,86.96 U$2.P$27 U$2.P$30 U$2.P$25 U$2.P$22 156,84.42 | U$2.P$32 161.03,89.03 159,87 | 156,84.42 156.42,84.42 158,86 | U$2.P$17 155.53,84 156,84
  pour Bottom: 15,191 52,191 52,165 143,165 143,191 152,191 152,81 143,81 143,159 53,159 52,81 42,81 42,153 15,153
DISTRI_VBAT  (via drill 2)  (4 unrouted)
  Top 0.203: 56,87 U$7.P$28 | 56,87 U$7.P$23 | U$7.P$23 54,85.01 54,85 53.41,85 U$7.P$18 U$7.P$21 U$7.P$26 | 58.53,84.47 U$7.P$26 | 58.53,84.47 U$7.P$31 61.03,87.74 59.78,88.98 59.78,89.22 59,90 | U$7.P$20 53.5,89.5 56,87 | U$7.P$23 56.04,86.96 58.53,84.47 | U$7.P$26 U$7.P$29 | U$2.P$23 U$2.P$20 | U$2.P$23 U$2.P$28 158.62,89.37 U$2.P$31 159.03,84.97 | 158.53,84.47 159.03,84.97 | 158.53,84.47 U$2.P$26 U$2.P$29 | U$2.P$23 157.94,84.97 159.03,84.97 | U$2.P$23 U$2.P$18 U$2.P$21 158.07,84 159,84 159,84.47 158.53,84.47 | U$11.P$20 U$11.P$23 | 156,187 U$11.P$23 | 156,187 U$11.P$28 U$11.P$31 158.53,184.47 | 158.53,184.47 U$11.P$26 | U$11.P$26 158.49,184.51 156,187 | U$11.P$23 U$11.P$18 154.19,184.42 155.43,183.18 155.82,183.18 157,182 | U$11.P$21 155.95,181.95 156,182 158,184 158,184.47 158.53,184.47 | U$11.P$26 U$11.P$29
  Top 0.254: U$9.P$20 55.91,187 55.99,187 | U$9.P$23 56,186.96 56,187 55.99,187 | U$9.P$18 55.99,187 | U$9.P$23 U$9.P$28 | U$9.P$21 58.07,184 58.49,184 | 58.91,184 59,184 | 58.49,184 U$9.P$26 U$9.P$31 59,188.99 59,189 | U$9.P$23 55.95,186.54 58.49,184 | U$9.P$29 58.91,184 | 58.91,184 58.49,184
  Top 2.54: U$9.P$21 55.95,168 v56,168 | 59,91 56,94 v56,156 v140,156 | v155,156 155,180.06 155.82,180.88 155.82,181.82 156,182 | v155,156 158.62,152.38 158.62,89.37 | v155,156 227.5,156 JP1.P$1 233,162.5 233,155 227,155
  Route2 2.54: v56,168 v56,156 | v140,156 v155,156 156,156
EPS  (via drill 1)  (12 unrouted)
  Top 1.27: U$7.P$34 63.57,136 | 63.57,136 63.57,152 v63,152 | v63,167 63.57,167 U$9.P$36 | U$11.P$36 164,189.5 v164,162 | v164,149 164,81.88 U$2.P$33 | 63.57,136 63.57,138 v141,138
  Route2 1.27: v63,152 v63,167 | v63,167 63,168 v63,167 | v164,162 165,162 165,149 v164,149 164,138 v141,138
ESTIMAT_GND  (via drill 0.5)  (7 unrouted)
  Top 0.254: U$2.P$79 191.51,98
  Top 0.508: 191.51,98 228,98 v228,83
  Top 1.27: U$3.11 U$19.11
  Route2 0.254: 245.87,56 U$19.11
  Route2 0.406: U$7.P$80 91.51,86.22 92.65,85.08 92.65,57.35 93,57 93,56.6
  Route2 0.508: 93,56.6 U$3.11 | v228,83 228,56 245.87,56
  Route3 0.406: U$9.P$80 91.51,186.03 90.37,184.89 90.37,181.41 91.51,180.27 U$7.P$79 | U$11.P$80 U$11.P$79 191.51,186.03 190.37,184.89 190.37,181.41 191.51,180.27 U$2.P$79
ESTIMAT_VBAT  (via drill 0.5)  (8 unrouted)
  Top 0.254: U$2.P$77 191.51,85.16 190.24,86.43 190.24,98.19 191,98.95 191,99
  Top 0.508: 191,99 229,99 v229,84
  Top 1.27: U$19.10 U$3.10
  Route2 0.254: 246.13,59 U$19.10
  Route2 0.406: U$9.P$78 91.51,91.11 90.37,89.97 90.37,86.49 91.51,85.35 U$7.P$77 91.51,59 | U$11.P$78 191.51,91.11 190.37,89.97 190.37,86.49 191.51,85.35 U$2.P$77 | 4.13,59 U$3.10
  Route2 0.508: 91.51,59 4.13,59 | v229,84 229,59 246.13,59
PPT_GND
  pour Top: 15,165 42,165 42,191 52,191 52,165 143,165 143,191 152,191 152,81 143,81 143,159 53,159 52,81 42,81 42,153 15,153
SYNC1  (via drill 0.5)  (4 unrouted)
  Top 0.254: U$2.P$45 171.19,82.62 169.92,83.89 169.92,84.95 169.99,85.01 169.99,86.37 169.92,86.43 169.92,104.92 170,105
  Top 0.508: 170,105 235,105 v235,90
  Top 1.27: U$19.4 U$3.4
  Route2 0.203: U$9.P$45 71.19,90.96 70.16,89.93 70.16,83.99 71.19,82.96 U$7.P$45 | U$11.P$45 171.19,90.96 170.16,89.93 170.16,83.99 171,83.15 171,81
  Route2 0.254: 246.13,74 U$19.4
  Route2 0.406: U$7.P$45 71.19,74.38 | U$3.4 U$13.4
  Route2 0.508: U$13.4 71.19,74.38 | v235,90 235,74 246.13,74
SYNC2  (via drill 0.5)  (3 unrouted)
  Top 0.254: U$2.P$49 173.73,82.62 175,83.89 175,84.95 174.26,85.69 173.2,85.69 172.46,86.43 172.46,90.03 173,90.57 173,104
  Top 0.508: 173,104 234,104 v234,89
  Top 1.27: U$3.5 U$19.5
  Route2 0.152: 239,72 245.71,72 U$19.5
  Route2 0.203: U$9.P$49 73.73,90.96 72.69,89.93 72.69,83.31 74,82 | U$11.P$49 173.73,90.96 172.69,89.93 172.69,83.99 173.73,82.96 U$2.P$49
  Route2 0.254: 239.87,72 U$17.5
  Route2 0.406: U$7.P$49 73.73,71.84 | U$13.5 U$3.5
  Route2 0.508: 73.73,71.84 U$13.5 | v234,89 234,72 239,72 239.87,72
TOPDEPLOY+  (5 unrouted)
  Top 1.27: U$19.16 3.9,43.9 3,43
  Route2 0.203: U$9.P$55 76.27,185.88 75.23,184.85 75.23,183.99 76.31,182.92 76.7,182.92 77.31,182.31 77.31,89.07 76.27,88.04 U$7.P$55 | U$2.P$55 176.27,88.04 177.31,89.07 177.31,184.85 176.27,185.88 U$11.P$55
  Bottom 0.203: U$9.P$51 73.73,187.74 72.44,188.98 72.44,190.02 70.99,194 11,194 11,91 22,80 | 22,80 22,43.9 U$3.16 | U$9.P$55 76.27,187.74 77.52,188.98 77.52,190.02 81.05,193.56 137.18,193.56 137.73,193 169.5,193 172.49,190.02 172.49,188.98 173.73,187.74 173.73,187 U$11.P$51 U$11.P$55 | 22,80 73,76 | 73,76 73.61,80 74.97,81.36 74.97,84.94 73.73,86.18 U$7.P$51 U$7.P$55 | 73,76 173.61,76 174.97,81.36 174.97,84.94 174,85.91 174,87 173.73,87 U$2.P$51 U$2.P$55
  Bottom 0.406: U$9.P$51 U$9.P$55
TOPDEPLOY-  (4 unrouted)
  Top 0.203: U$7.P$52 U$7.P$56 | U$2.P$56 U$2.P$52
  Top 1.27: U$3.17 U$19.17
  Route2 0.203: U$7.P$52 73.73,90.39 74.77,91.42 74.77,187.39 73.73,188.42 U$9.P$52 U$9.P$56 | U$2.P$52 173.73,90.39 174.76,91.42 174.76,187.39 173.73,188.42 U$11.P$52
  Bottom 0.203: U$9.P$52 73,189.5 73,195 10,195 10,85 11,85 2.12,85 1.12,86 1.12,41 | 1.12,41 9.87,41 U$13.17 | U$9.P$56 76.27,194 174,194 174,189.5 U$11.P$52 U$11.P$56 | 1.12,41 1.12,30 211,30 211,87.27 210.44,87.82 210.44,93.56 209,95 177,95 177,92 | 177,92 177,89 | 177,92 168.63,92 167.35,90.72 167.35,81.36 167,81.01 167,78 110,78 110,93 76,93 76,90 73.73,90 U$7.P$52
WHEEL_GND  (via drill 0.5)  (9 unrouted)
  Top 0.254: U$2.P$71 186.43,100
  Top 0.508: 186.43,100 230,100 v230,85
  Top 1.27: U$3.9 247,61.68 247,62
  Route2 0.406: U$7.P$71 86.43,86.22 87.57,85.08 87.57,62.43 88,62 88,61.68 | U$13.9 U$3.9
  Route2 0.508: 88,61.68 U$13.9 | v230,85 230,62 247,62
  Route3 0.406: U$9.P$72 86.43,186.03 85.29,184.89 85.29,181.41 86.43,180.27 U$7.P$71 | U$11.P$72 186.43,186.03 185.29,184.89 185.29,181.41 186.43,180.27 U$2.P$71
WHEEL_VBAT  (via drill 0.5)  (6 unrouted)
  Top 0.254: U$2.P$69 U$2.P$70 186.43,85.16 185.16,86.43 185.16,99.38 185.25,100.96 186,101
  Top 0.508: 186,101 231,101 v231,86
  Top 1.27: U$19.8 U$3.8
  Route2 0.254: 231,64 231,64.22
  Route2 0.406: U$9.P$70 86.43,91.11 85.29,89.97 85.29,86.49 86.43,85.35 U$7.P$69 86.43,64.22 | U$11.P$70 186.43,91.11 185.29,89.97 185.29,86.49 186.43,85.35 U$2.P$70 | U$13.8 U$3.8
  Route2 0.508: 86.43,64.22 U$13.8 | v231,86 231,64.22 U$19.8

### Text on the board
tSilk: PPT+ | EXTERNAL / POWER- | PPT- | EXTERNAL / POWER+ | Husky / Satellite / Lab | GND / GND / GND / Sync1 / Sync2 / CANH / CANL / WHEEL_VBAT / WHEEL_GND / ESIMAT_VBAT / ESTIMAT_GND / BDOT_VBAT / BDOT_GND / / / TOPDEPLOY+ / TOPDEPLOY- | GND / GND / GND / Sync1 / Sync2 / CANH / CANL / WHEEL_VBAT / WHEEL_GND / ESIMAT_VBAT / ESTIMAT_GND / BDOT_VBAT / BDOT_GND / / / TOPDEPLOY+ / TOPDEPLOY- | MSP430 port | P3.5_GPIO_DEBUG / P3.4_GPIO_DEBUG / GND / GND / P2.1_RXD / P2.0_TXD / SBWTDIO / SBWTCK